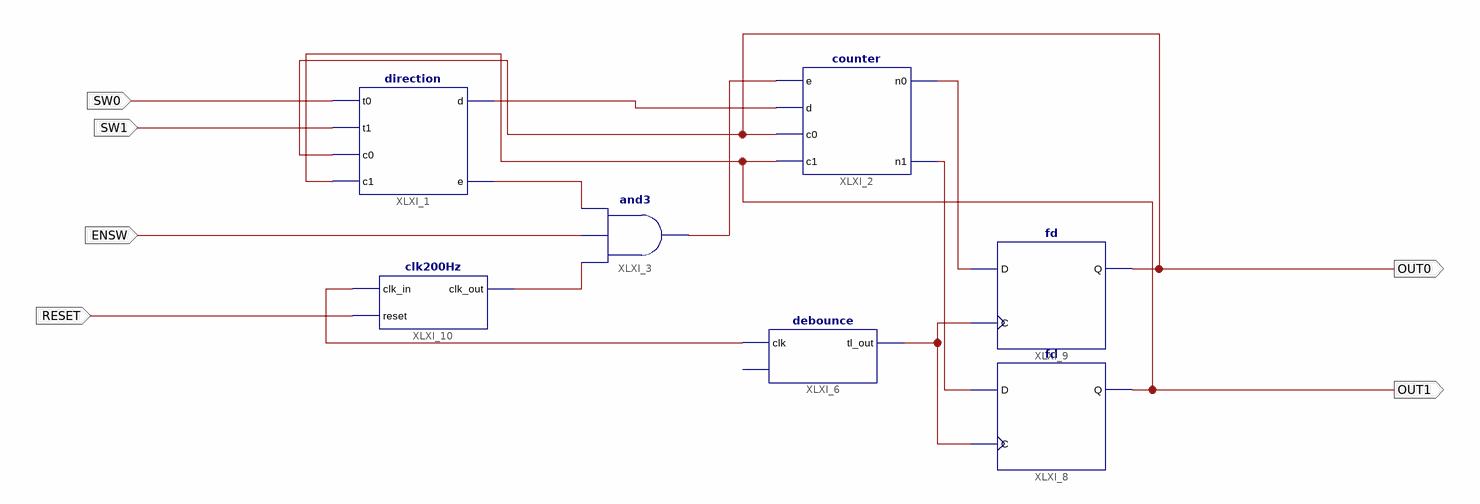
[diagram p0: schematic sheet 1]
// Xilinx ISE schematic schema.sch (spartan3e) as structural Verilog: 7 symbols, 6 ports
module schema (
  input  ENSW,
  input  SW0,
  input  SW1,
  input  RESET,
  output OUT1,
  output OUT0
);

  wire XLXN_1, XLXN_2, XLXN_4, XLXN_5, XLXN_6, XLXN_28, XLXN_31, XLXN_33;

  direction XLXI_1 (.t0(SW0), .t1(SW1), .c0(OUT0), .c1(OUT1), .d(XLXN_4), .e(XLXN_2));
  counter XLXI_2 (.e(XLXN_1), .d(XLXN_4), .c0(OUT0), .c1(OUT1), .n0(XLXN_6), .n1(XLXN_5));
  and XLXI_3 (XLXN_1, XLXN_33, ENSW, XLXN_2);
  debounce XLXI_6 (.clk(XLXN_31), .tl_out(XLXN_28));  // open: tl_in
  fd XLXI_8 (.C(XLXN_28), .D(XLXN_5), .Q(OUT1));
  fd XLXI_9 (.C(XLXN_28), .D(XLXN_6), .Q(OUT0));
  clk200Hz XLXI_10 (.clk_in(XLXN_31), .reset(RESET), .clk_out(XLXN_33));
endmodule
